# EAGLE design i2cping_hw1.0 (EAGLE 9.4.0)
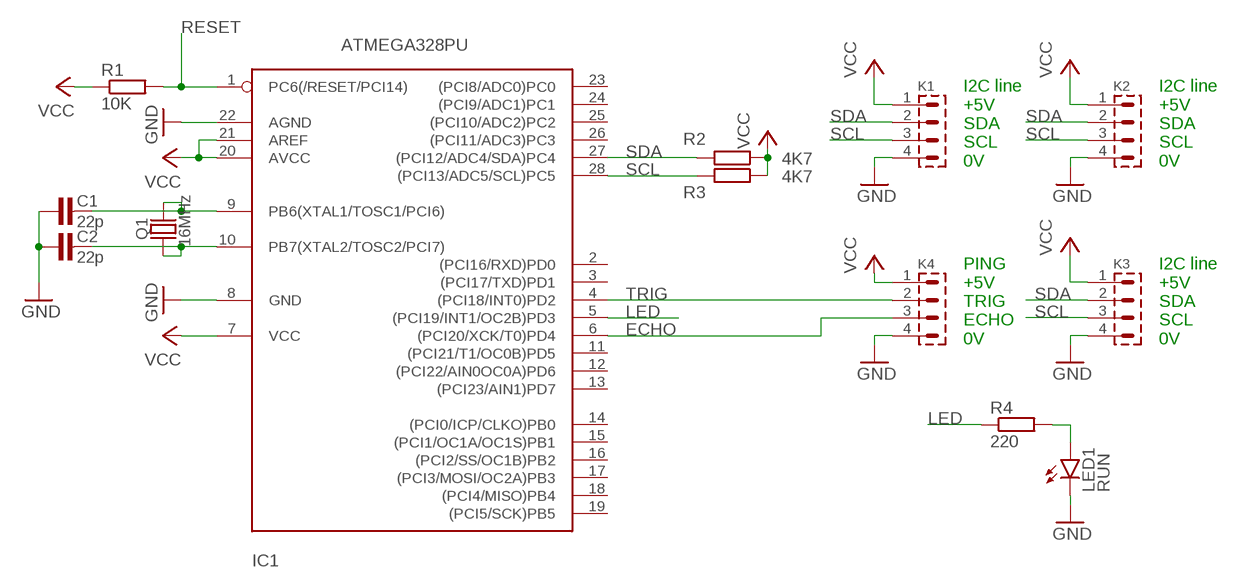
[diagram p0: schematic, sheet 1]

## Parts
C1  22p  C-KER_5  [C-5]
C2  22p  C-KER_5  [C-5]
IC1  ATMEGA328PU  ATMEGA168-20P  [DIL28-3]
K1  PSH02-04P  [PSH02-04P]
K2  PSH02-04P  [PSH02-04P]
K3  PSH02-04P  [PSH02-04P]
K4  PSH02-04P  [PSH02-04P]
LED1  RUN  LED5MM  [LED5MM]
Q1  16MHz  Q_HC-49U  [HC-49U]
R1  10K  R-EU_0207/7  [0207/7]
R2  4K7  R-EU_0207/7  [0207/7]
R3  4K7  R-EU_0207/7  [0207/7]
R4  220  R-EU_0207/7  [0207/7]

## Nets
ECHO: IC1.6((PCI20/XCK/T0)PD4) K4.3
GND: C1.1 C2.1 IC1.8(GND) IC1.22(AGND) K1.4 K2.4 K3.4 K4.4 LED1.K(C)
LED: IC1.5((PCI19/INT1/OC2B)PD3) R4.1
N$2: C1.2 IC1.9(PB6(XTAL1/TOSC1/PCI6)) Q1.2
N$3: LED1.A R4.2
Q1: C2.2 IC1.10(PB7(XTAL2/TOSC2/PCI7)) Q1.1
RESET: IC1.1(PC6(/RESET/PCI14)) R1.2
SCL: IC1.28((PCI13/ADC5/SCL)PC5) K1.3 K2.3 K3.3 R3.2
SDA: IC1.27((PCI12/ADC4/SDA)PC4) K1.2 K2.2 K3.2 R2.2
TRIG: IC1.4((PCI18/INT0)PD2) K4.2
VCC: IC1.7(VCC) IC1.20(AVCC) IC1.21(AREF) K1.1 K2.1 K3.1 K4.1 R1.1 R2.1 R3.1
Unconnected: IC1.2((PCI16/RXD)PD0) IC1.3((PCI17/TXD)PD1) IC1.11((PCI21/T1/OC0B)PD5) IC1.12((PCI22/AIN0OC0A)PD6) IC1.13((PCI23/AIN1)PD7) IC1.14((PCI0/ICP/CLKO)PB0) IC1.15((PCI1/OC1A/OC1S)PB1) IC1.16((PCI2/SS/OC1B)PB2) IC1.17((PCI3/MOSI/OC2A)PB3) IC1.18((PCI4/MISO)PB4) IC1.19((PCI5/SCK)PB5) IC1.23((PCI8/ADC0)PC0) IC1.24((PCI9/ADC1)PC1) IC1.25((PCI10/ADC2)PC2) IC1.26((PCI11/ADC3)PC3)

## Notes on the sheet
- I2C line
  +5V
  SDA
  SCL
  0V
- I2C line
  +5V
  SDA
  SCL
  0V
- PING
  +5V
  TRIG
  ECHO
  0V
- I2C line
  +5V
  SDA
  SCL
  0V

## Library data of the parts
C1 C2 = #PaJa_31:C-KER: Kondenzator - keramicky
IC1 = adafruit:ATMEGA168*P: MICROCONTROLLER 16 kBytes FLASH 1 kBytes SRAM 512 Bytes EEPROM USART 8-channel 10 bit ADC
K1-K4 = #PaJa_konektory:PSH02-04: Konektory se zamkem - vidlice - 4pin
LED1 = led:LED: LED OSRAM: - CHIPLED LG R971, LG N971, LY N971, LG Q971, LY Q971, LO R971, LY R971 LH N974, LH R974 LS Q976, LO Q976, LY Q976 LO Q996 - Hyper CHIPLED LW Q18S LB Q993, LB Q99A, LB R99A - SideLED LS A670, LO A670, LY A670, LG A670, LP A670 LB A673, LV A673, LT A673, LW A673 LH A674 LY A675 LS A676, LA A676, LO A676, LY A676, LW A676 LS A679, LY A679, LG A679 - Hyper Micro SIDELED® LS Y876, LA Y876, LO Y876, LY Y876 LT Y87S - SmartLED LW L88C, LW L88S LB L89C, LB L89S, LG L890 LS L89K, LO L89K, LY L89K LS L896, LA L896, LO L896, LY L896 - TOPLED LS T670, LO T670, LY T670, LG T670, LP T670 LSG T670, LSP T670, LSY T670, LOP T670, LYG T670 LG T671, LOG T671, LSG T671 LB T673, LV T673, LT T673, LW T673 LH T674 LS T676, LA T676, LO T676, LY T676, LB T676, LH T676, LSB T676, LW T676 LB T67C, LV T67C, LT T67C, LS T67K, LO T67K, LY T67K, LW E67C LS E67B, LA E67B, LO E67B, LY E67B, LB E67C, LV E67C, LT E67C LW T67C LS T679, LY T679, LG T679 LS T770, LO T770, LY T770, LG T770, LP T770 LB T773, LV T773, LT T773, LW T773 LH T774 LS E675, LA E675, LY E675, LS T675 LS T776, LA T776, LO T776, LY T776, LB T776 LHGB T686 LT T68C, LB T68C - Hyper Mini TOPLED® LB M676 - Mini TOPLED Santana® LG M470 LS M47K, LO M47K, LY M47K Source: http://www.osram.convergy.de LUXEON: - LUMILED® LXK2-PW12-R00, LXK2-PW12-S00, LXK2-PW14-U00, LXK2-PW14-V00 LXK2-PM12-R00, LXK2-PM12-S00, LXK2-PM14-U00 LXK2-PE12-Q00, LXK2-PE12-R00, LXK2-PE12-S00, LXK2-PE14-T00, LXK2-PE14-U00 LXK2-PB12-K00, LXK2-PB12-L00, LXK2-PB12-M00, LXK2-PB14-N00, LXK2-PB14-P00, LXK2-PB14-Q00 LXK2-PR12-L00, LXK2-PR12-M00, LXK2-PR14-Q00, LXK2-PR14-R00 LXK2-PD12-Q00, LXK2-PD12-R00, LXK2-PD12-S00 LXK2-PH12-R00, LXK2-PH12-S00 LXK2-PL12-P00, LXK2-PL12-Q00, LXK2-PL12-R00 Source: www.luxeon.com KINGBRIGHT: KA-3528ASYC Source: www.kingbright.com
Q1 = #PaJa_31:Q: Krystal HC-49 - 1MHz - 48MHz DT38 - Quartz (hodinovy) 32,768kHz
R1-R4 = rcl:R-EU_: RESISTOR, European symbol

## Board
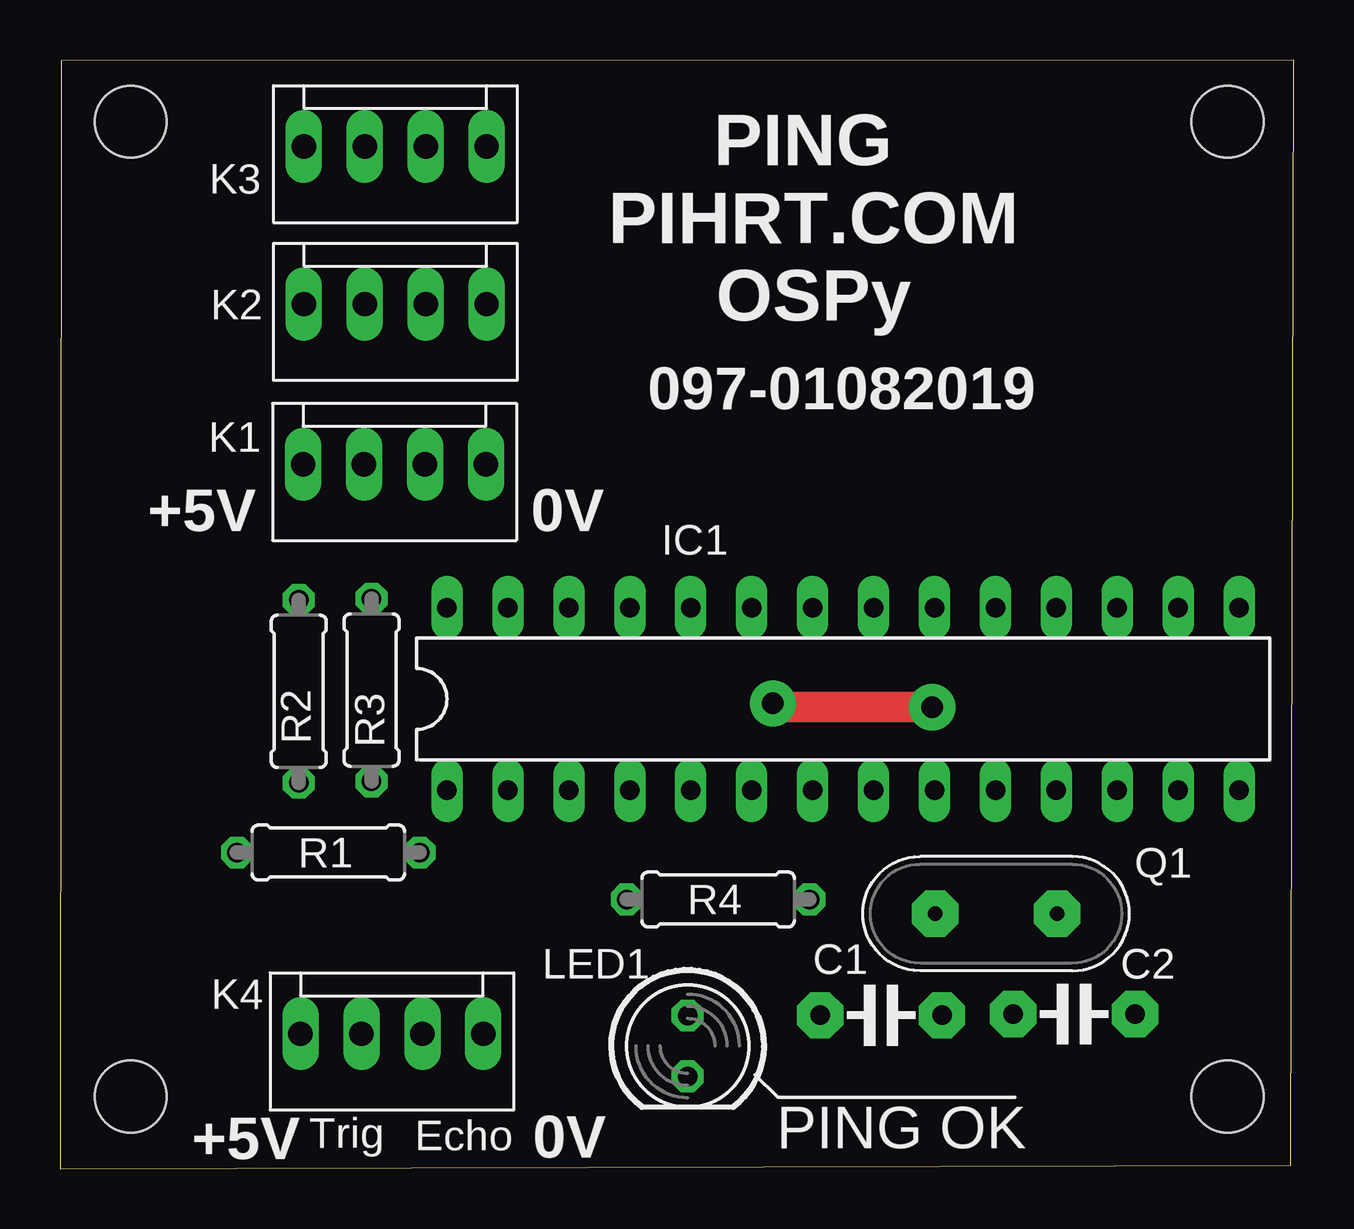
[diagram p1: board, top side]
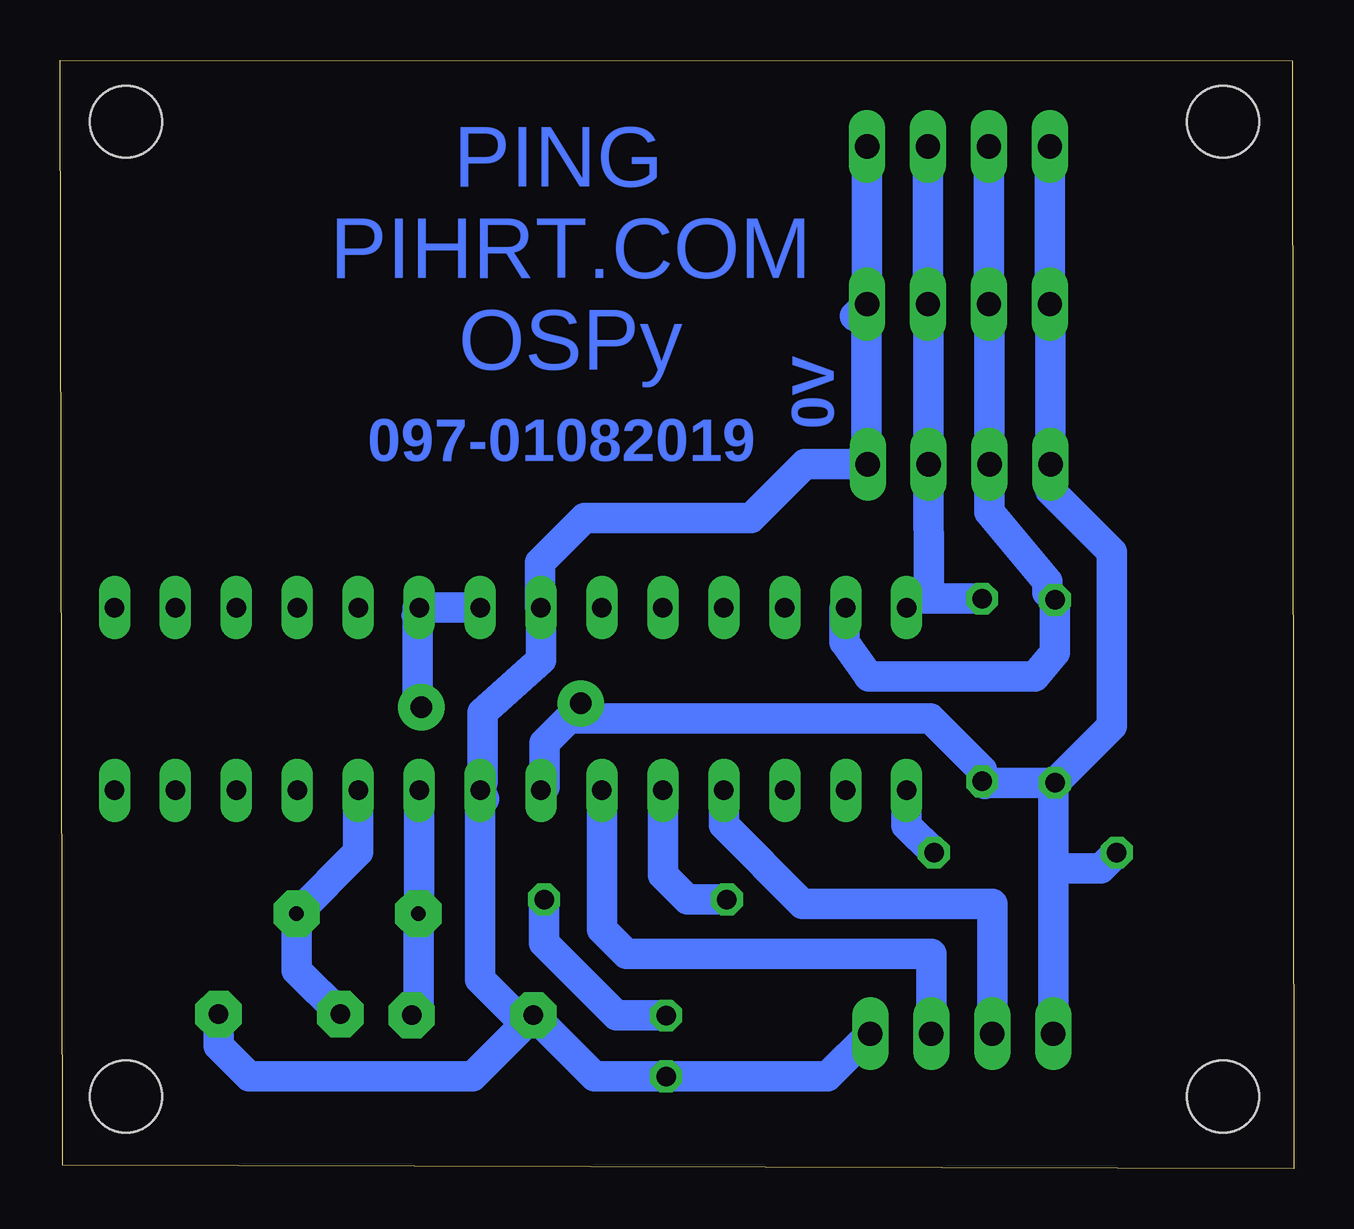
[diagram p2: board, bottom side, seen from below]

Size 51.42 x 46.21 mm. Coordinates in mm from the lower left corner, seen from the top.
Outline: 0,0 51.31,0.14 51.42,46.21 0.06,46.18 0,0
Copper layers (1*16): Top 0.035mm / dielectric 1.5mm / Bottom 0.035mm
Design rules "default *": minimum track width 10mil, minimum drill 24mil, track to track 8mil, track to pad 8mil, pad to pad 8mil, via to via 8mil, smd to smd 8mil, copper to edge 40mil, drill to drill 8mil, minimum pad ring 10mil, minimum via ring 8mil, stop-mask expansion 4mil, vias tented up to drill 0mil, thermal gap 10mil
Holes 3 mm at 48.67,3 2.95,3 2.95,43.64 48.67,43.64

### Footprints (pad centres in the part's own frame; a part is rotated, then mirrored left to right if it is on the bottom)
C-5 = drill 0.813 pad 1.93 octagon: 1 -2.54,0; 2 2.54,0
DIL28-3 = drill 0.813 long: 1 -16.51,-3.81; 2 -13.97,-3.81; 3 -11.43,-3.81; 4 -8.89,-3.81; 5 -6.35,-3.81; 6 -3.81,-3.81; 7 -1.27,-3.81; 8 1.27,-3.81; 9 3.81,-3.81; 10 6.35,-3.81; 11 8.89,-3.81; 12 11.43,-3.81; 13 13.97,-3.81; 14 16.51,-3.81; 15 16.51,3.81; 16 13.97,3.81; 17 11.43,3.81; 18 8.89,3.81; 19 6.35,3.81; 20 3.81,3.81; 21 1.27,3.81; 22 -1.27,3.81; 23 -3.81,3.81; 24 -6.35,3.81; 25 -8.89,3.81; 26 -11.43,3.81; 27 -13.97,3.81; 28 -16.51,3.81
PSH02-04P = drill 1.016 pad 1.422 long: 1 -3.81,0; 2 -1.27,0; 3 1.27,0; 4 3.81,0
LED5MM = drill 0.813 octagon: A -1.27,0; K 1.27,0
HC-49U = drill 0.61 pad 1.93 octagon: 1 -2.54,0; 2 2.54,0
0207/7 = drill 0.813 octagon: 1 -3.81,0; 2 3.81,0

### Placement (x,y rotation side)
C1  34.22,6.39 0 top
C2  42.27,6.44 180 top
IC1  32.64,19.57 0 top
K1  13.94,29.36 0 top
K2  13.97,36.03 0 top
K3  13.97,42.6 0 top
K4  13.84,5.62 0 top
LED1  26.16,5.11 270 top
Q1  39.02,10.62 180 top
R1  11.18,13.17 0 top
R2  9.95,19.89 90 top
R3  12.99,19.95 90 top
R4  27.43,11.22 0 top

### Tracks (layer width: path | path; a pad name or v marks a point on that pad's centre or on a via)
ECHO
  Bottom 1.27: K4.3 15.11,8.94 27.81,8.94 28.83,9.96 IC1.6
GND
  Bottom 1.27: IC1.8 33.81,16.12 33.81,19.02 31.37,21.2 IC1.22 31.4,23.41 31.4,25.27 29.56,27.11 22.62,27.11 20.37,29.36 K1.4 17.82,29.42 17.82,36 K2.4 | 33.74,15.41 IC1.8 | K3.4 K2.4 | 18.29,35.53 K2.4 | K4.4 19.42,3.84 LED1.K 29.13,3.84 C1.1 | C1.1 34.23,3.84 43.54,3.84 44.81,5.11 C2.1 | IC1.8 33.91,7.88 32.42,6.39 C1.1
LED
  Bottom 1.27: R4.1 25.27,11.22 26.29,12.24 IC1.5
N$2
  Bottom 1.27: IC1.9 36.45,10.65 Q1.2 36.48,6.67 C1.2
N$3
  Bottom 1.27: R4.2 31.24,9.4 28.22,6.38 LED1.A
Q1
  Bottom 1.27: IC1.10 38.99,13.19 Q1.1 41.56,8.27 C2.2
RESET
  Bottom 1.27: IC1.1 16.13,14.31 R1.2
SCL
  Bottom 1.27: R3.2 15.42,23.76 | 15.42,23.76 15.76,23.76 IC1.28 | 15.42,23.76 15.21,23.79 K1.3 15.21,36 K2.3 K3.3
SDA
  Bottom 1.27: IC1.27 18.72,23.34 18.72,21.95 17.7,20.52 10.78,20.52 9.95,21.52 R2.2 10.26,24 10.26,24.48 12.67,27.38 K1.2 12.67,36 K2.2 K3.2
TRIG
  Bottom 1.27: IC1.4 23.75,14.32 20.46,11.03 12.57,11.03 K4.2
VCC  (via drill 0.9 pad 1.93)
  Top 1.27: v36.36,19.23 29.87,19.23 v29.72,19.39
  Bottom 0.813: IC1.20 36.78,23.06
  Bottom 1.27: R2.1 12.93,16.08 R3.1 | R3.1 12.88,16.02 | IC1.20 IC1.21 36.47,23.38 36.51,23.34 36.51,19.39 v36.36,19.23 | R2.1 7.58,18.45 7.58,25.71 10.13,28.26 K1.1 10.13,36 K2.1 K3.1 | R3.1 12.99,16.61 15.15,18.77 29.2,18.77 | 29.2,18.77 30.2,18.77 31.23,17.74 31.23,15.91 IC1.7 | v29.72,19.39 29.72,19.28 29.2,18.77 | R2.1 10.03,16.01 10.03,12.51 | 10.03,12.51 K4.1 | R1.1 8.03,12.51 10.03,12.51

### Text on the board
Bottom: PING / PIHRT.COM / OSPy | + | 0V | 097-01082019
tNames: PING / PIHRT.COM / OSPy | 097-01082019 | +5V | 0V | 0V | +5V | Trig | Echo | PING OK